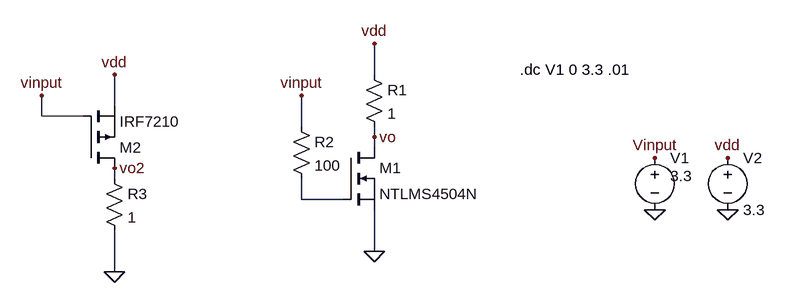
[diagram p0: schematic power_mosfet.asc]
power_mosfet.asc, the LTspice schematic file:
Version 4
SHEET 1 880 680
WIRE 144 -32 144 -80
WIRE -256 16 -256 -32
WIRE -368 32 -368 0
WIRE -304 32 -368 32
WIRE 32 48 32 0
WIRE 144 64 144 48
WIRE 144 80 144 64
WIRE -256 128 -256 112
WIRE 32 160 32 128
WIRE 96 160 32 160
WIRE 144 240 144 176
WIRE -256 272 -256 208
FLAG 144 240 0
FLAG 576 176 0
FLAG 576 96 Vinput
FLAG 688 176 0
FLAG 144 -80 vdd
FLAG 32 0 vinput
FLAG 144 64 vo
FLAG 688 96 vdd
FLAG -256 272 0
FLAG -256 -32 vdd
FLAG -368 0 vinput
FLAG -256 112 vo2
SYMBOL nmos 96 80 R0
SYMATTR InstName M1
SYMATTR Value NTLMS4504N
SYMBOL res 128 -48 R0
SYMATTR InstName R1
SYMATTR Value 1
SYMBOL voltage 576 80 R0
WINDOW 3 24 44 Left 2
WINDOW 123 0 0 Left 2
WINDOW 39 0 0 Left 2
SYMATTR InstName V1
SYMATTR Value 3.3
SYMBOL voltage 688 80 R0
WINDOW 123 0 0 Left 2
WINDOW 39 0 0 Left 2
SYMATTR InstName V2
SYMATTR Value 3.3
SYMBOL res 16 32 R0
SYMATTR InstName R2
SYMATTR Value 100
SYMBOL res -272 112 R0
SYMATTR InstName R3
SYMATTR Value 1
SYMBOL pmos -304 112 M180
SYMATTR InstName M2
SYMATTR Value IRF7210
TEXT 368 -40 Left 2 !.dc V1 0 3.3 .01

The netlist it stands for:
* power_mosfet.asc
M1 vo N001 0 0 NTLMS4504N
R1 vdd vo 1
V1 Vinput 0 3.3
V2 vdd 0 3.3
R2 Vinput N001 100
R3 vo2 0 1
M2 vo2 Vinput vdd vdd IRF7210
.model NMOS NMOS
.model PMOS PMOS
.lib standard.mos
.dc V1 0 3.3 .01
.backanno
.end